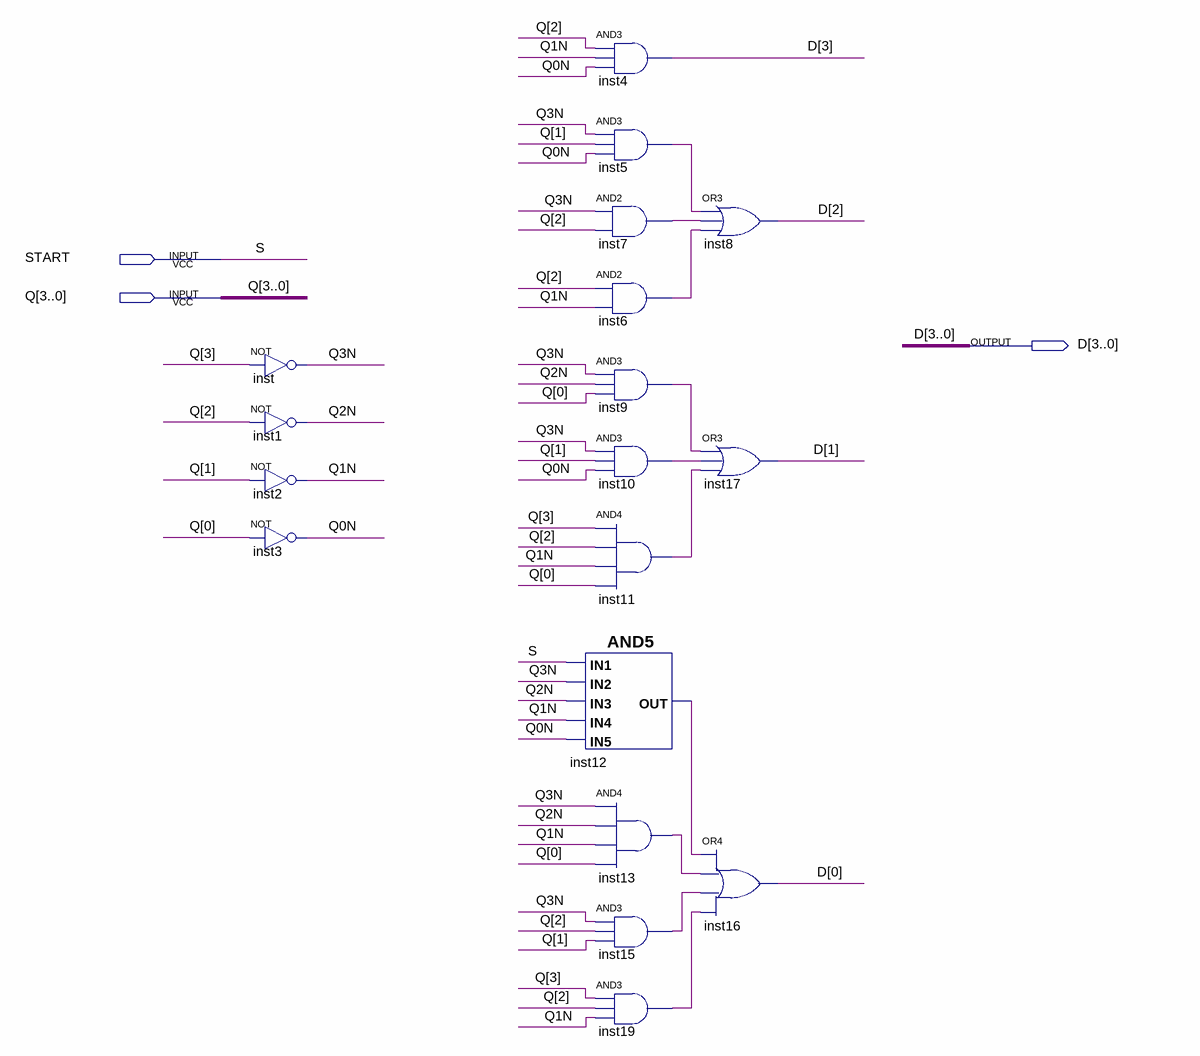
[diagram p0: schematic sheet]
// Quartus schematic NEXT_STATE.bdf as structural Verilog: 18 symbols, 3 pins
module NEXT_STATE (
  input  START,
  input  [3:0] Q,
  output [3:0] D
);

  wire inst5_out, inst6_out, inst7_out, inst9_out, inst10_out, inst11_out, inst12_out, inst13_out,
       inst15_out, inst19_out, Q0N, Q1N, Q2N, Q3N;

  not inst (Q3N, Q[3]);
  not inst1 (Q2N, Q[2]);
  not inst2 (Q1N, Q[1]);
  not inst3 (Q0N, Q[0]);
  and inst12 (inst12_out, START, Q3N, Q2N, Q1N, Q0N);
  and inst4 (D[3], Q[2], Q1N, Q0N);
  and inst5 (inst5_out, Q3N, Q[1], Q0N);
  and inst7 (inst7_out, Q3N, Q[2]);
  and inst6 (inst6_out, Q[2], Q1N);
  and inst9 (inst9_out, Q3N, Q2N, Q[0]);
  and inst10 (inst10_out, Q3N, Q[1], Q0N);
  and inst11 (inst11_out, Q[3], Q[2], Q1N, Q[0]);
  and inst13 (inst13_out, Q3N, Q2N, Q1N, Q[0]);
  and inst15 (inst15_out, Q3N, Q[2], Q[1]);
  and inst19 (inst19_out, Q[3], Q[2], Q1N);
  or inst8 (D[2], inst5_out, inst7_out, inst6_out);
  or inst17 (D[1], inst9_out, inst10_out, inst11_out);
  or inst16 (D[0], inst12_out, inst13_out, inst15_out, inst19_out);

  // Other names for the same wires on the sheet: S = START
endmodule
